# EAGLE board ADCS (EAGLE 9.6.0)
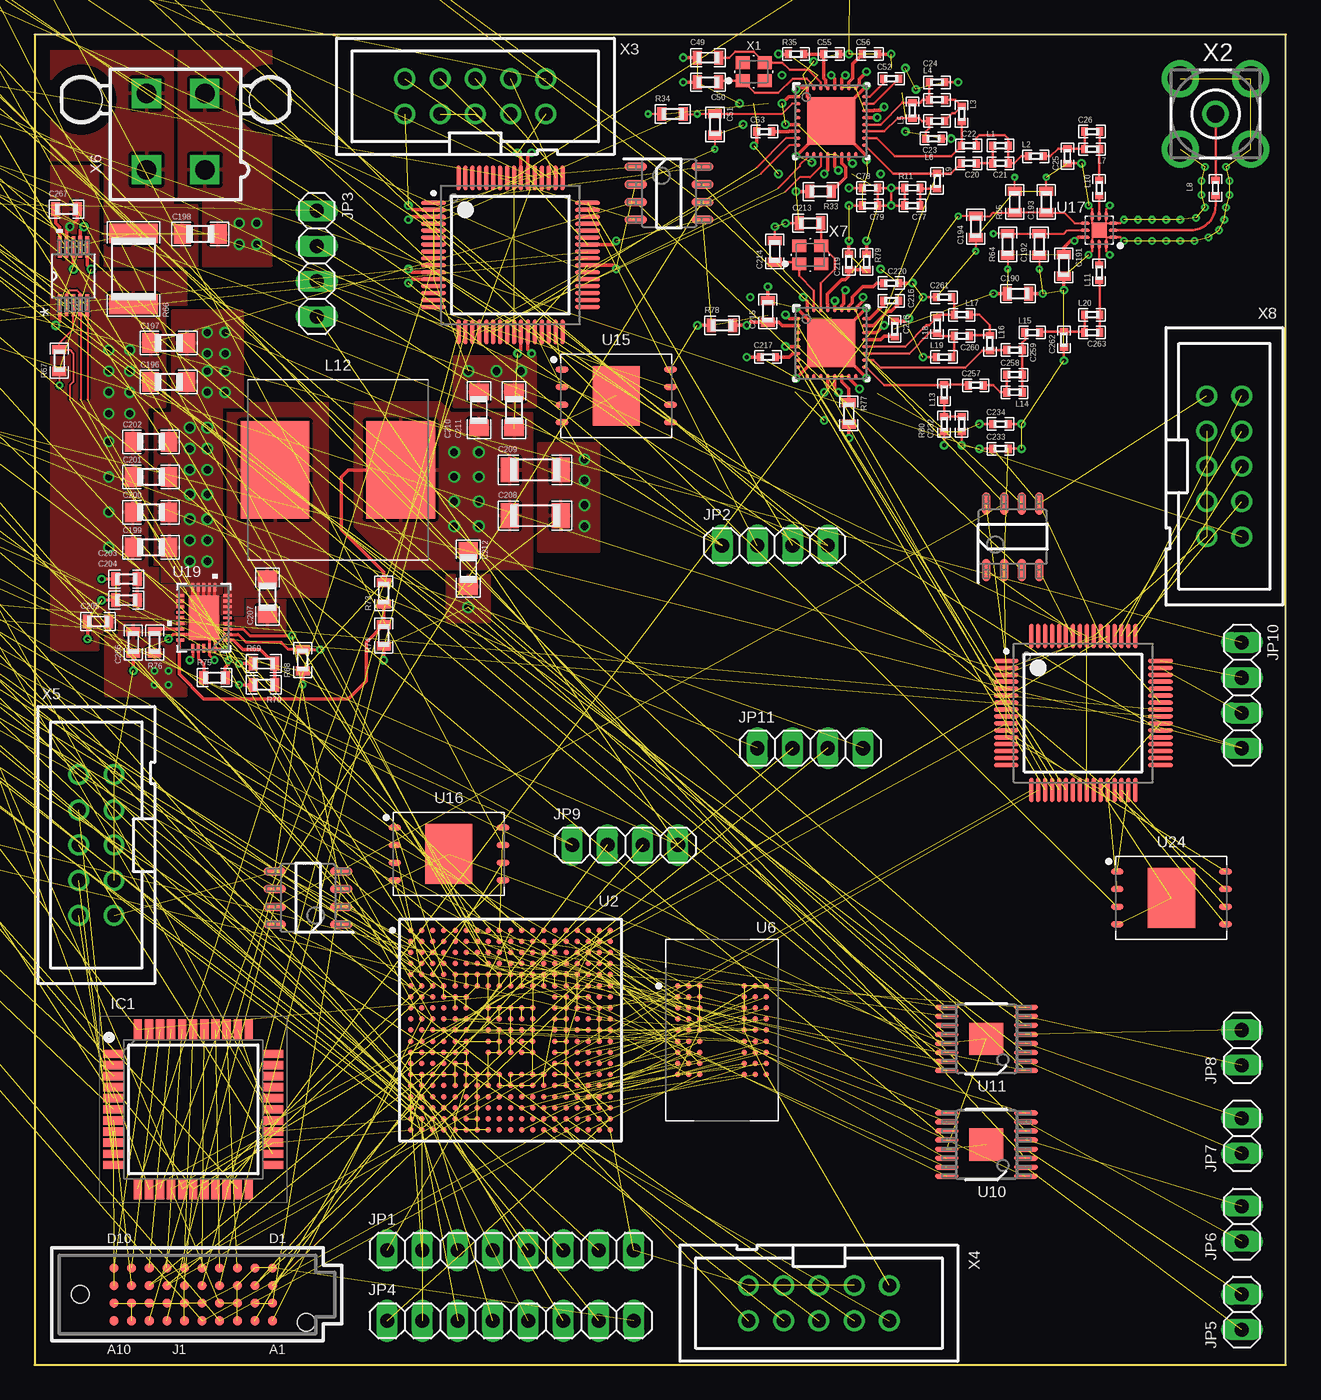
[diagram p13: board, top side]
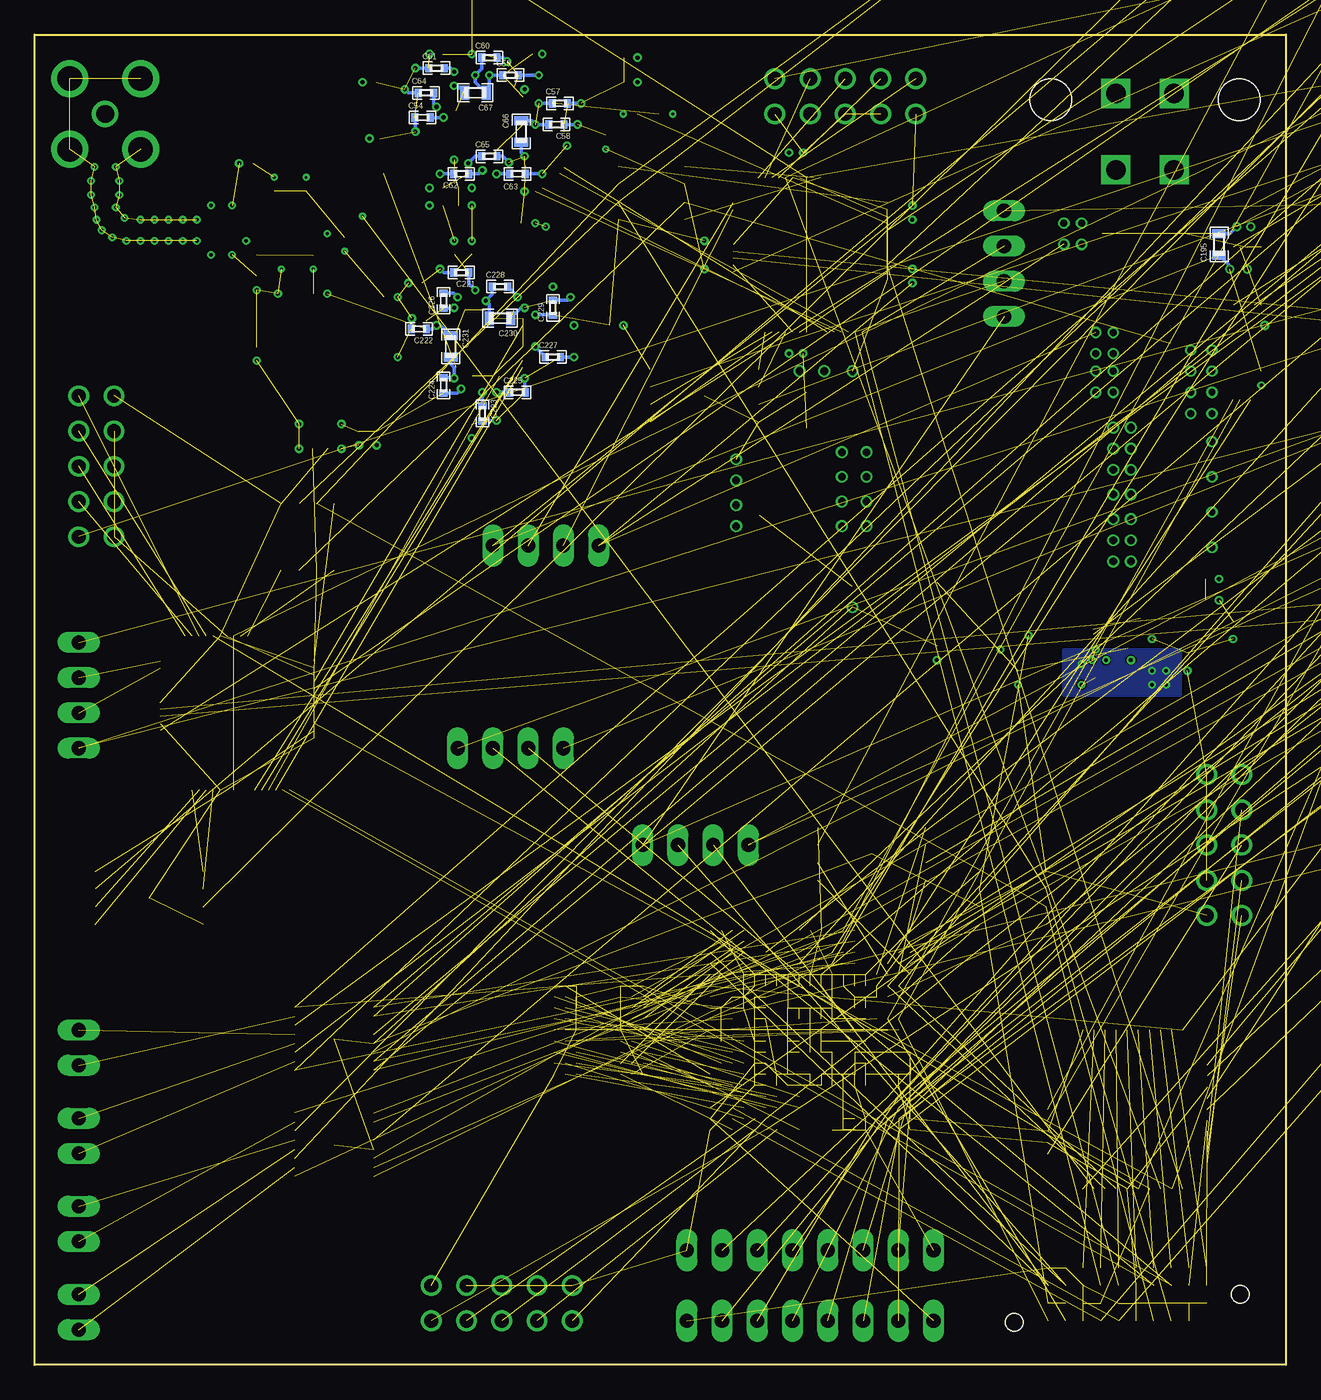
[diagram p14: board, bottom side, seen from below]

Size 90.17 x 95.89 mm. Coordinates in mm from the lower left corner, seen from the top.
Outline: 0,0 90.17,0 90.17,95.89 0,95.89 0,0
Copper layers (1+2*3+14*15+16): Top 0.035mm / dielectric 0.12mm / Route2 0.035mm / dielectric 0.12mm / Route3 0.035mm / dielectric 0.91mm / Route14 0.035mm / dielectric 0.12mm / Route15 0.035mm / dielectric 0.12mm / Bottom 0.035mm
Design rules "default *": minimum track width 4mil, minimum drill 0.2mm, track to track 4mil, track to pad 4mil, pad to pad 4mil, via to via 4mil, smd to smd 4mil, copper to edge 40mil, drill to drill 6mil, minimum pad ring 10mil, minimum via ring 6mil, stop-mask expansion 4mil, vias tented up to drill 0mil, thermal gap 10mil

## Footprints (pad centres in the part's own frame; a part is rotated, then mirrored left to right if it is on the bottom)
0603 = smd 0.65 x 1: 1 -0.775,0; 2 0.775,0
0402 = smd 0.5 x 0.6: 1 -0.55,0; 2 0.55,0
0805 = smd 1.2 x 1.4: 1 -1.3,0; 2 1.3,0
1206 = smd 1.3 x 1.8: 1 -1.85,0; 2 1.85,0
QFP80P1200X1200X120-44N = smd 1.475 x 0.6: 1 -5.738,4; 2 -5.738,3.2; 3 -5.738,2.4; 4 -5.738,1.6; 5 -5.738,0.8; 6 -5.738,0; 7 -5.738,-0.8; 8 -5.738,-1.6; 9 -5.738,-2.4; 10 -5.738,-3.2; 11 -5.738,-4; 23 5.738,-4; 24 5.738,-3.2; 25 5.738,-2.4; 26 5.738,-1.6; 27 5.738,-0.8; 28 5.738,0; 29 5.738,0.8; 30 5.738,1.6; 31 5.738,2.4; 32 5.738,3.2; 33 5.738,4 | smd 0.6 x 1.475: 12 -4,-5.738; 13 -3.2,-5.738; 14 -2.4,-5.738; 15 -1.6,-5.738; 16 -0.8,-5.738; 17 0,-5.738; 18 0.8,-5.738; 19 1.6,-5.738; 20 2.4,-5.738; 21 3.2,-5.738; 22 4,-5.738; 34 4,5.738; 35 3.2,5.738; 36 2.4,5.738; 37 1.6,5.738; 38 0.8,5.738; 39 0,5.738; 40 -0.8,5.738; 41 -1.6,5.738; 42 -2.4,5.738; 43 -3.2,5.738; 44 -4,5.738
SEAF-10-XX.X-XX-04-X-A = smd 0.635 x 0.635: A1 5.715,-1.905; A2 4.445,-1.905; A3 3.175,-1.905; A4 1.905,-1.905; A5 0.635,-1.905; A6 -0.635,-1.905; A7 -1.905,-1.905; A8 -3.175,-1.905; A9 -4.445,-1.905; A10 -5.715,-1.905; B1 5.715,-0.635; B2 4.445,-0.635; B3 3.175,-0.635; B4 1.905,-0.635; B5 0.635,-0.635; B6 -0.635,-0.635; B7 -1.905,-0.635; B8 -3.175,-0.635; B9 -4.445,-0.635; B10 -5.715,-0.635; C1 5.715,0.635; C2 4.445,0.635; C3 3.175,0.635; C4 1.905,0.635; C5 0.635,0.635; C6 -0.635,0.635; C7 -1.905,0.635; C8 -3.175,0.635; C9 -4.445,0.635; C10 -5.715,0.635; D1 5.715,1.905; D2 4.445,1.905; D3 3.175,1.905; D4 1.905,1.905; D5 0.635,1.905; D6 -0.635,1.905; D7 -1.905,1.905; D8 -3.175,1.905; D9 -4.445,1.905; D10 -5.715,1.905 | hole 1.27: 8.141,-2.007; -8.141,0
1X08 = drill 1.016 long: 1 -8.89,0; 2 -6.35,0; 3 -3.81,0; 4 -1.27,0; 5 1.27,0; 6 3.81,0; 7 6.35,0; 8 8.89,0
1X04 = drill 1.016 long: 1 -3.81,0; 2 -1.27,0; 3 1.27,0; 4 3.81,0
1X02 = drill 1.016 long: 1 -1.27,0; 2 1.27,0
BOURNS-INDUCTOR-SRR1208-4R5ML = smd 4.96 x 7.012: 1 -4.525,0; 2 4.525,0
1812 = smd 1.4 x 3.5: 1 -2.55,0; 2 2.55,0
TEXAS_INSTRUMENTS-RADAR-CC1200RHBR = smd 0.36 x 0.24: 1 -2.4,1.75; 2 -2.4,1.25; 3 -2.4,0.75; 4 -2.4,0.25; 5 -2.4,-0.25; 6 -2.4,-0.75; 7 -2.4,-1.25; 8 -2.4,-1.75; 17 2.4,-1.75; 18 2.4,-1.25; 19 2.4,-0.75; 20 2.4,-0.25; 21 2.4,0.25; 22 2.4,0.75; 23 2.4,1.25; 24 2.4,1.75 | smd 0.24 x 0.36: 9 -1.75,-2.4; 10 -1.25,-2.4; 11 -0.75,-2.4; 12 -0.25,-2.4; 13 0.25,-2.4; 14 0.75,-2.4; 15 1.25,-2.4; 16 1.75,-2.4; 25 1.75,2.4; 26 1.25,2.4; 27 0.75,2.4; 28 0.25,2.4; 29 -0.25,2.4; 30 -0.75,2.4; 31 -1.25,2.4; 32 -1.75,2.4 | smd 3.45 x 3.45: 33 0,0
ZWT0337A-IPC_A = smd 0.4 x 0.4: A1 -7.2,7.2; A2 -6.4,7.2; A3 -5.6,7.2; A4 -4.8,7.2; A5 -4,7.2; A6 -3.2,7.2; A7 -2.4,7.2; A8 -1.6,7.2; A9 -0.8,7.2; A10 0,7.2; A11 0.8,7.2; A12 1.6,7.2; A13 2.4,7.2; A14 3.2,7.2; A15 4,7.2; A16 4.8,7.2; A17 5.6,7.2; A18 6.4,7.2; A19 7.2,7.2; B1 -7.2,6.4; B2 -6.4,6.4; B3 -5.6,6.4; B4 -4.8,6.4; B5 -4,6.4; B6 -3.2,6.4; B7 -2.4,6.4; B8 -1.6,6.4; B9 -0.8,6.4; B10 0,6.4; B11 0.8,6.4; B12 1.6,6.4; B13 2.4,6.4; B14 3.2,6.4; B15 4,6.4; B16 4.8,6.4; B17 5.6,6.4; B18 6.4,6.4; B19 7.2,6.4; C1 -7.2,5.6; C2 -6.4,5.6; C3 -5.6,5.6; C4 -4.8,5.6; C5 -4,5.6; C6 -3.2,5.6; C7 -2.4,5.6; C8 -1.6,5.6; C9 -0.8,5.6; C10 0,5.6; C11 0.8,5.6; C12 1.6,5.6; C13 2.4,5.6; C14 3.2,5.6; C15 4,5.6; C16 4.8,5.6; C17 5.6,5.6; C18 6.4,5.6; C19 7.2,5.6; D1 -7.2,4.8; D2 -6.4,4.8; D3 -5.6,4.8; D4 -4.8,4.8; D5 -4,4.8; D6 -3.2,4.8; D7 -2.4,4.8; D8 -1.6,4.8; D9 -0.8,4.8; D10 0,4.8; D11 0.8,4.8; D12 1.6,4.8; D13 2.4,4.8; D14 3.2,4.8; D15 4,4.8; D16 4.8,4.8; D17 5.6,4.8; D18 6.4,4.8; D19 7.2,4.8; E1 -7.2,4; E2 -6.4,4; E3 -5.6,4; E4 -4.8,4; E5 -4,4; E6 -3.2,4; E7 -2.4,4; E8 -1.6,4; E9 -0.8,4; E10 0,4; E11 0.8,4; E12 1.6,4; E13 2.4,4; E14 3.2,4; E15 4,4; E16 4.8,4; E17 5.6,4; E18 6.4,4; E19 7.2,4; F1 -7.2,3.2; F2 -6.4,3.2; F3 -5.6,3.2; F4 -4.8,3.2; F5 -4,3.2; F6 -3.2,3.2; F7 -2.4,3.2; F8 -1.6,3.2; F9 -0.8,3.2; F10 0,3.2; F11 0.8,3.2; F12 1.6,3.2; F13 2.4,3.2; F14 3.2,3.2; F15 4,3.2; F16 4.8,3.2; F17 5.6,3.2; F18 6.4,3.2; F19 7.2,3.2; G1 -7.2,2.4; G2 -6.4,2.4; G3 -5.6,2.4; G4 -4.8,2.4; G5 -4,2.4; G6 -3.2,2.4; G14 3.2,2.4; G15 4,2.4; G16 4.8,2.4; G17 5.6,2.4; G18 6.4,2.4; G19 7.2,2.4; H1 -7.2,1.6; H2 -6.4,1.6; H3 -5.6,1.6; H4 -4.8,1.6; H5 -4,1.6; H6 -3.2,1.6; H8 -1.6,1.6; H9 -0.8,1.6; H10 0,1.6; H11 0.8,1.6; H12 1.6,1.6; H14 3.2,1.6; H15 4,1.6; H16 4.8,1.6; H17 5.6,1.6; H18 6.4,1.6; H19 7.2,1.6; J1 -7.2,0.8; J2 -6.4,0.8; J3 -5.6,0.8; J4 -4.8,0.8; J5 -4,0.8; J6 -3.2,0.8; J8 -1.6,0.8; J9 -0.8,0.8; J10 0,0.8; J11 0.8,0.8; J12 1.6,0.8; J14 3.2,0.8; J15 4,0.8; J16 4.8,0.8; J17 5.6,0.8; J18 6.4,0.8; J19 7.2,0.8; K1 -7.2,0; K2 -6.4,0; K3 -5.6,0; K4 -4.8,0; K5 -4,0; K6 -3.2,0; K8 -1.6,0; K9 -0.8,0; K10 0,0; K11 0.8,0; K12 1.6,0; K14 3.2,0; K15 4,0; K16 4.8,0; K17 5.6,0; K18 6.4,0; K19 7.2,0; L1 -7.2,-0.8; L2 -6.4,-0.8; L3 -5.6,-0.8; L4 -4.8,-0.8; L5 -4,-0.8; L6 -3.2,-0.8; L8 -1.6,-0.8; L9 -0.8,-0.8; L10 0,-0.8; L11 0.8,-0.8; L12 1.6,-0.8; L14 3.2,-0.8; L15 4,-0.8; L16 4.8,-0.8; L17 5.6,-0.8; L18 6.4,-0.8; L19 7.2,-0.8; M1 -7.2,-1.6; M2 -6.4,-1.6; M3 -5.6,-1.6; M4 -4.8,-1.6; M5 -4,-1.6; M6 -3.2,-1.6; M8 -1.6,-1.6; M9 -0.8,-1.6; M10 0,-1.6; M11 0.8,-1.6; M12 1.6,-1.6; M14 3.2,-1.6; M15 4,-1.6; M16 4.8,-1.6; M17 5.6,-1.6; M18 6.4,-1.6; M19 7.2,-1.6; N1 -7.2,-2.4; N2 -6.4,-2.4; N3 -5.6,-2.4; N4 -4.8,-2.4; N5 -4,-2.4; N6 -3.2,-2.4; N14 3.2,-2.4; N15 4,-2.4; N16 4.8,-2.4; N17 5.6,-2.4; N18 6.4,-2.4; N19 7.2,-2.4; P1 -7.2,-3.2; P2 -6.4,-3.2; P3 -5.6,-3.2; P4 -4.8,-3.2; P5 -4,-3.2; P6 -3.2,-3.2; P7 -2.4,-3.2; P8 -1.6,-3.2; P9 -0.8,-3.2; P10 0,-3.2; P11 0.8,-3.2; P12 1.6,-3.2; P13 2.4,-3.2; P14 3.2,-3.2; P15 4,-3.2; P16 4.8,-3.2; P17 5.6,-3.2; P18 6.4,-3.2; P19 7.2,-3.2; R1 -7.2,-4; R2 -6.4,-4; R3 -5.6,-4; R4 -4.8,-4; R5 -4,-4; R6 -3.2,-4; R7 -2.4,-4; R8 -1.6,-4; R9 -0.8,-4; R10 0,-4; R11 0.8,-4; R12 1.6,-4; R13 2.4,-4; R14 3.2,-4; R15 4,-4; R16 4.8,-4; R17 5.6,-4; R18 6.4,-4; R19 7.2,-4; T1 -7.2,-4.8; T2 -6.4,-4.8; T3 -5.6,-4.8; T4 -4.8,-4.8; T5 -4,-4.8; T6 -3.2,-4.8; T7 -2.4,-4.8; T8 -1.6,-4.8; T9 -0.8,-4.8; T10 0,-4.8; T11 0.8,-4.8; T12 1.6,-4.8; T13 2.4,-4.8; T14 3.2,-4.8; T15 4,-4.8; T16 4.8,-4.8; T17 5.6,-4.8; T18 6.4,-4.8; T19 7.2,-4.8; U1 -7.2,-5.6; U2 -6.4,-5.6; U3 -5.6,-5.6; U4 -4.8,-5.6; U5 -4,-5.6; U6 -3.2,-5.6; U7 -2.4,-5.6; U8 -1.6,-5.6; U9 -0.8,-5.6; U10 0,-5.6; U11 0.8,-5.6; U12 1.6,-5.6; U13 2.4,-5.6; U14 3.2,-5.6; U15 4,-5.6; U16 4.8,-5.6; U17 5.6,-5.6; U18 6.4,-5.6; U19 7.2,-5.6; V1 -7.2,-6.4; V2 -6.4,-6.4; V3 -5.6,-6.4; V4 -4.8,-6.4; V5 -4,-6.4; V6 -3.2,-6.4; V7 -2.4,-6.4; V8 -1.6,-6.4; V9 -0.8,-6.4; V10 0,-6.4; V11 0.8,-6.4; V12 1.6,-6.4; V13 2.4,-6.4; V14 3.2,-6.4; V15 4,-6.4; V16 4.8,-6.4; V17 5.6,-6.4; V18 6.4,-6.4; V19 7.2,-6.4; W1 -7.2,-7.2; W2 -6.4,-7.2; W3 -5.6,-7.2; W4 -4.8,-7.2; W5 -4,-7.2; W6 -3.2,-7.2; W7 -2.4,-7.2; W8 -1.6,-7.2; W9 -0.8,-7.2; W10 0,-7.2; W11 0.8,-7.2; W12 1.6,-7.2; W13 2.4,-7.2; W14 3.2,-7.2; W15 4,-7.2; W16 4.8,-7.2; W17 5.6,-7.2; W18 6.4,-7.2; W19 7.2,-7.2
PM0064A_N = smd 1.8 x 0.3: 1 -5.55,3.75; 2 -5.55,3.25; 3 -5.55,2.75; 4 -5.55,2.25; 5 -5.55,1.75; 6 -5.55,1.25; 7 -5.55,0.75; 8 -5.55,0.25; 9 -5.55,-0.25; 10 -5.55,-0.75; 11 -5.55,-1.25; 12 -5.55,-1.75; 13 -5.55,-2.25; 14 -5.55,-2.75; 15 -5.55,-3.25; 16 -5.55,-3.75; 33 5.55,-3.75; 34 5.55,-3.25; 35 5.55,-2.75; 36 5.55,-2.25; 37 5.55,-1.75; 38 5.55,-1.25; 39 5.55,-0.75; 40 5.55,-0.25; 41 5.55,0.25; 42 5.55,0.75; 43 5.55,1.25; 44 5.55,1.75; 45 5.55,2.25; 46 5.55,2.75; 47 5.55,3.25; 48 5.55,3.75 | smd 0.3 x 1.8: 17 -3.75,-5.55; 18 -3.25,-5.55; 19 -2.75,-5.55; 20 -2.25,-5.55; 21 -1.75,-5.55; 22 -1.25,-5.55; 23 -0.75,-5.55; 24 -0.25,-5.55; 25 0.25,-5.55; 26 0.75,-5.55; 27 1.25,-5.55; 28 1.75,-5.55; 29 2.25,-5.55; 30 2.75,-5.55; 31 3.25,-5.55; 32 3.75,-5.55; 49 3.75,5.55; 50 3.25,5.55; 51 2.75,5.55; 52 2.25,5.55; 53 1.75,5.55; 54 1.25,5.55; 55 0.75,5.55; 56 0.25,5.55; 57 -0.25,5.55; 58 -0.75,5.55; 59 -1.25,5.55; 60 -1.75,5.55; 61 -2.25,5.55; 62 -2.75,5.55; 63 -3.25,5.55; 64 -3.75,5.55
TEXAS_INSTRUMENTS-CAN_TRANSCEIVER-TCAN1042/LED_DRIVER-TLC59731DR = smd 1.6 x 0.6: 1 -2.4,1.905; 2 -2.4,0.635; 3 -2.4,-0.635; 4 -2.4,-1.905; 5 2.4,-1.905; 6 2.4,-0.635; 7 2.4,0.635; 8 2.4,1.905
TEXAS_INSTRUMENTS-AND_GATE-SN74LVC1G11_DCK_6 = smd 1.168 x 0.356: 1 -0.978,0.65; 2 -0.978,0; 3 -0.978,-0.65; 4 0.978,-0.65; 5 0.978,0; 6 0.978,0.65
ISSI-DRAM-IS42S16320F-7TL = smd 0.4 x 0.4: A1 -3.2,3.2; A2 -2.4,3.2; A3 -1.6,3.2; A7 1.6,3.2; A8 2.4,3.2; A9 3.2,3.2; B1 -3.2,2.4; B2 -2.4,2.4; B3 -1.6,2.4; B7 1.6,2.4; B8 2.4,2.4; B9 3.2,2.4; C1 -3.2,1.6; C2 -2.4,1.6; C3 -1.6,1.6; C7 1.6,1.6; C8 2.4,1.6; C9 3.2,1.6; D1 -3.2,0.8; D2 -2.4,0.8; D3 -1.6,0.8; D7 1.6,0.8; D8 2.4,0.8; D9 3.2,0.8; E1 -3.2,0; E2 -2.4,0; E3 -1.6,0; E7 1.6,0; E8 2.4,0; E9 3.2,0; F1 -3.2,-0.8; F2 -2.4,-0.8; F3 -1.6,-0.8; F7 1.6,-0.8; F8 2.4,-0.8; F9 3.2,-0.8; G1 -3.2,-1.6; G2 -2.4,-1.6; G3 -1.6,-1.6; G7 1.6,-1.6; G8 2.4,-1.6; G9 3.2,-1.6; H1 -3.2,-2.4; H2 -2.4,-2.4; H3 -1.6,-2.4; H7 1.6,-2.4; H8 2.4,-2.4; H9 3.2,-2.4; J1 -3.2,-3.2; J2 -2.4,-3.2; J3 -1.6,-3.2; J7 1.6,-3.2; J8 2.4,-3.2; J9 3.2,-3.2
SOT23-6 = smd 0.635 x 1.27: P$1 -0.953,-1.27; P$2 0,-1.27; P$3 0.953,-1.27; P$4 0.953,1.27; P$5 0,1.27; P$6 -0.953,1.27
PQFN50P250X300X100-14N = smd 0.58 x 0.35: 1 -1.16,0.75; 2 -1.16,0.25; 3 -1.16,-0.25; 4 -1.16,-0.75; 8 1.16,-0.75; 9 1.16,-0.25; 10 1.16,0.25; 11 1.16,0.75 | smd 0.35 x 0.58: 5 -0.5,-0.91; 6 0,-0.91; 7 0.5,-0.91; 12 0.5,0.91; 13 0,0.91; 14 -0.5,0.91
PWP0016K_N = smd 1.7 x 0.35: 1 -2.85,2.275; 2 -2.85,1.625; 3 -2.85,0.975; 4 -2.85,0.325; 5 -2.85,-0.325; 6 -2.85,-0.975; 7 -2.85,-1.625; 8 -2.85,-2.275; 9 2.85,-2.275; 10 2.85,-1.625; 11 2.85,-0.975; 12 2.85,-0.325; 13 2.85,0.325; 14 2.85,0.975; 15 2.85,1.625; 16 2.85,2.275 | smd 2.46 x 2.31: 17 0,0
TEXAS_INSTRUMENTS-CURRENT_MONITOR-INA226_DGS_10 = smd 1.575 x 0.279: 1 -2.095,1; 2 -2.095,0.5; 3 -2.095,0; 4 -2.095,-0.5; 5 -2.095,-1; 6 2.095,-1; 7 2.095,-0.5; 8 2.095,0; 9 2.095,0.5; 10 2.095,1
KIOXIA_AMERICA-NAND_FLASH-TC58CVG0S3HRAIG = smd 0.911 x 0.42: 1 -3.901,1.905; 2 -3.901,0.635; 3 -3.901,-0.635; 4 -3.901,-1.905; 5 3.901,-1.905; 6 3.901,-0.635; 7 3.901,0.635; 8 3.901,1.905 | smd 3.4 x 4.3: 9 0,0
QORVO-RF_SWITCH-QPC7512 = smd 0.687 x 0.232: 1 -1.012,0.5; 2 -1.012,0; 3 -1.012,-0.5; 7 1.012,-0.5; 8 1.012,0; 9 1.012,0.5 | smd 0.232 x 0.687: 4 -0.5,-1.012; 5 0,-1.012; 6 0.5,-1.012; 10 0.5,1.012; 11 0,1.012; 12 -0.5,1.012 | smd 1.1 x 1.1: 13 0,0
RVE28_TEX = smd 0.61 x 0.203: 1 -1.702,1.6; 2 -1.702,1.2; 3 -1.702,0.8; 4 -1.702,0.4; 5 -1.702,0; 6 -1.702,-0.4; 7 -1.702,-0.8; 8 -1.702,-1.2; 9 -1.702,-1.6; 15 1.702,-1.6; 16 1.702,-1.2; 17 1.702,-0.8; 18 1.702,-0.4; 19 1.702,0; 20 1.702,0.4; 21 1.702,0.8; 22 1.702,1.2; 23 1.702,1.6 | smd 0.203 x 0.61: 10 -0.8,-2.197; 11 -0.4,-2.197; 12 0,-2.197; 13 0.4,-2.197; 14 0.8,-2.197; 24 0.8,2.197; 25 0.4,2.197; 26 0,2.197; 27 -0.4,2.197; 28 -0.8,2.197 | smd 2.21 x 3.2: 29 0,0
ECS_INC-OSCILLATOR-ECS-400-10-37-CKM-TR = smd 1.012 x 0.912: 1 -0.8,-0.65; 2 0.8,-0.65; 3 0.8,0.65; 4 -0.8,0.65
BU-SMA-V = drill 1.27: 1 0,0 | drill 1.778: 2 -2.55,2.55; 3 2.55,2.55; 4 2.55,-2.55; 5 -2.55,-2.55
PAK100/2500-10 = drill 1 pad 1.422: 1 -5.08,-1.27; 2 -5.08,1.27; 3 -2.54,-1.27; 4 -2.54,1.27; 5 0,-1.27; 6 0,1.27; 7 2.54,-1.27; 8 2.54,1.27; 9 5.08,-1.27; 10 5.08,1.27
5566-4 = drill 1.4 square: 1 2.1,-2.75; 2 -2.1,-2.75; 3 2.1,2.75; 4 -2.1,2.75 | hole 3: 6.8,2.29; -6.8,2.29
ESC-OSCILLATOR-ECS_200_9_33B_CTP_TR = smd 1.312 x 1.212: 1 -1.2,-0.9; 2 1.2,-0.9; 3 1.2,0.9; 4 -1.2,0.9

## Placement (x,y rotation side)
C1  0.1uF  [0603]  -39.37,101.6 0 top  (outside the outline)
C2  0.1uF  [0603]  -43.18,101.6 0 top  (outside the outline)
C3  DNI  [0603]  -46.99,101.6 0 top  (outside the outline)
C4  DNI  [0603]  -50.8,101.6 0 top  (outside the outline)
C5  2.2uF  [0603]  -54.61,101.6 0 top  (outside the outline)
C6  1uF  [0603]  -58.42,101.6 0 top  (outside the outline)
C7  0.1uF  [0603]  57.91,100.08 0 top  (outside the outline)
C8  0.1uF  [0603]  -66.04,101.6 0 top  (outside the outline)
C9  1uF  [0603]  -69.85,101.6 0 top  (outside the outline)
C10  1uF  [0603]  -73.66,101.6 0 top  (outside the outline)
C11  10uF  [0603]  -77.47,101.6 0 top  (outside the outline)
C12  4.7uF  [0603]  -81.28,101.6 0 top  (outside the outline)
C13  1uF  [0603]  -85.09,101.6 0 top  (outside the outline)
C14  1uF  [0603]  -88.9,101.6 0 top  (outside the outline)
C15  0.1uF  [0603]  -92.71,101.6 0 top  (outside the outline)
C16  0.1uF  [0603]  -96.52,101.6 0 top  (outside the outline)
C17  0.1uF  [0603]  -100.33,101.6 0 top  (outside the outline)
C18  0.1uF  [0603]  -104.14,101.6 0 top  (outside the outline)
C19  1uF  [0603]  -107.95,101.6 0 top  (outside the outline)
C20  15pF  [0402]  67.31,86.61 0 top
C21  1pF  [0402]  69.6,86.61 0 top
C22  2.2pF  [0402]  67.31,87.88 180 top
C23  3.3pF  [0402]  65.02,89.66 0 top
C24  3.3pF  [0402]  65.02,92.46 180 top
C25  3pF  [0402]  74.42,87.12 270 top
C26  DNI  [0402]  76.2,88.9 0 top
C27  0.1uF  [0402]  -63.5,132.08 0 top  (outside the outline)
C28  0.1uF  [0402]  -66.04,132.08 0 top  (outside the outline)
C29  1uF  [0402]  -68.58,132.08 0 top  (outside the outline)
C30  0.01uF  [0603]  -19.05,105.41 0 top  (outside the outline)
C31  0.1uF  [0603]  -22.86,105.41 0 top  (outside the outline)
C32  0.01uF  [0603]  -26.67,105.41 0 top  (outside the outline)
C33  0.1uF  [0402]  -71.12,132.08 0 top  (outside the outline)
C34  0.1uF  [0402]  -73.66,132.08 0 top  (outside the outline)
C35  0.1uF  [0402]  -76.2,132.08 0 top  (outside the outline)
C36  0.1uF  [0402]  -78.74,132.08 0 top  (outside the outline)
C37  0.1uF  [0402]  -81.28,132.08 0 top  (outside the outline)
C38  0.1uF  [0402]  -83.82,132.08 0 top  (outside the outline)
C39  0.1uF  [0402]  -86.36,132.08 0 top  (outside the outline)
C40  0.1uF  [0402]  -88.9,132.08 0 top  (outside the outline)
C41  0.1uF  [0402]  -91.44,132.08 0 top  (outside the outline)
C42  0.1uF  [0402]  -93.98,132.08 0 top  (outside the outline)
C43  0.1uF  [0402]  -96.52,132.08 0 top  (outside the outline)
C44  0.1uF  [0402]  -99.06,132.08 0 top  (outside the outline)
C45  0.1uF  [0402]  -101.6,132.08 0 top  (outside the outline)
C46  0.1uF  [0402]  -104.14,132.08 0 top  (outside the outline)
C47  0.1uF  [0402]  -106.68,132.08 0 top  (outside the outline)
C48  0.1uF  [0402]  -109.22,132.08 0 top  (outside the outline)
C49  10pF  [0603]  48.51,94.23 180 top
C50  10pF  [0603]  48.51,92.46 180 top
C51  0.1uF  [0603]  49.02,89.41 270 top
C52  1.5nF  [0402]  61.72,92.71 0 top
C53  220nF  [0402]  52.58,88.9 0 top
C54  10nF  [0402]  62.23,89.92 0 bottom
C55  47nF  [0402]  57.4,94.49 180 top
C56  47nF  [0402]  60.2,94.49 180 top
C57  47nF  [0402]  52.32,90.93 0 bottom
C58  47nF  [0402]  52.58,89.41 0 bottom
C59  47nF  [0402]  55.88,92.96 0 bottom
C60  47nF  [0402]  57.4,94.23 0 bottom
C61  47nF  [0402]  61.21,93.47 180 bottom
C62  47nF  [0402]  59.44,85.85 180 bottom
C63  47nF  [0402]  55.37,85.85 0 bottom
C64  47nF  [0402]  61.98,91.69 180 bottom
C65  47nF  [0402]  57.4,87.12 0 bottom
C66  10uF  [0603]  55.12,88.9 270 bottom
C67  2.2uF  [0603]  58.42,91.69 180 bottom
C68  0.1uF  [0402]  -29.21,135.89 0 top  (outside the outline)
C69  0.1uF  [0402]  -31.75,135.89 0 top  (outside the outline)
C70  0.1uF  [0402]  -34.29,135.89 0 top  (outside the outline)
C71  0.1uF  [0402]  -36.83,135.89 0 top  (outside the outline)
C72  0.1uF  [0402]  -39.37,135.89 0 top  (outside the outline)
C73  0.1uF  [0402]  -41.91,135.89 0 top  (outside the outline)
C74  0.1uF  [0402]  -44.45,135.89 0 top  (outside the outline)
C75  0.1uF  [0402]  -46.99,135.89 0 top  (outside the outline)
C76  0.1uF  [0402]  -49.53,135.89 0 top  (outside the outline)
C77  33pF  [0402]  63.25,83.57 0 top
C78  10nF  [0402]  60.2,84.84 180 top
C79  100pF  [0402]  60.2,83.57 180 top
C80  0.1uF  [0402]  -59.69,135.89 0 top  (outside the outline)
C81  0.1uF  [0402]  -62.23,135.89 0 top  (outside the outline)
C82  0.1uF  [0402]  -64.77,135.89 0 top  (outside the outline)
C83  0.1uF  [0402]  -67.31,135.89 0 top  (outside the outline)
C84  0.1uF  [0402]  -69.85,135.89 0 top  (outside the outline)
C85  1uF  [0402]  -72.39,135.89 0 top  (outside the outline)
C86  1uF  [0402]  -74.93,135.89 0 top  (outside the outline)
C87  1uF  [0402]  -77.47,135.89 0 top  (outside the outline)
C88  2.2uF  [0402]  -80.01,135.89 0 top  (outside the outline)
C89  4.7uF  [0603]  -49.53,105.41 0 top  (outside the outline)
C90  10uF  [0603]  -53.34,105.41 0 top  (outside the outline)
C91  2.2uF  [0402]  -82.55,135.89 0 top  (outside the outline)
C92  2.2uF  [0402]  -85.09,135.89 0 top  (outside the outline)
C93  0.1uF  [0402]  -87.63,135.89 0 top  (outside the outline)
C94  0.1uF  [0402]  -90.17,135.89 0 top  (outside the outline)
C95  0.1uF  [0402]  -92.71,135.89 0 top  (outside the outline)
C96  0.1uF  [0402]  -95.25,135.89 0 top  (outside the outline)
C97  2.2uF  [0402]  -97.79,135.89 0 top  (outside the outline)
C98  0.1uF  [0402]  -100.33,135.89 0 top  (outside the outline)
C99  0.1uF  [0402]  -102.87,135.89 0 top  (outside the outline)
C100  0.1uF  [0402]  -105.41,135.89 0 top  (outside the outline)
C101  0.1uF  [0402]  -107.95,135.89 0 top  (outside the outline)
C102  0.1uF  [0402]  -110.49,135.89 0 top  (outside the outline)
C103  0.1uF  [0402]  -113.03,135.89 0 top  (outside the outline)
C104  0.1uF  [0402]  -115.57,135.89 0 top  (outside the outline)
C105  0.1uF  [0402]  -118.11,135.89 0 top  (outside the outline)
C106  0.1uF  [0402]  -120.65,135.89 0 top  (outside the outline)
C107  0.1uF  [0402]  -123.19,135.89 0 top  (outside the outline)
C108  0.1uF  [0402]  -125.73,135.89 0 top  (outside the outline)
C109  0.1uF  [0402]  -128.27,135.89 0 top  (outside the outline)
C110  0.1uF  [0402]  -130.81,135.89 0 top  (outside the outline)
C111  0.1uF  [0402]  -13.97,139.7 0 top  (outside the outline)
C112  1uF  [0402]  -16.51,139.7 0 top  (outside the outline)
C113  1uF  [0402]  -19.05,139.7 0 top  (outside the outline)
C114  1uF  [0402]  -21.59,139.7 0 top  (outside the outline)
C115  4.7uF  [0603]  -57.15,105.41 0 top  (outside the outline)
C116  4.7uF  [0603]  -60.96,105.41 0 top  (outside the outline)
C117  10uF  [0603]  -64.77,105.41 0 top  (outside the outline)
C118  10nF  [0603]  -68.58,105.41 0 top  (outside the outline)
C119  10nF  [0603]  -72.39,105.41 0 top  (outside the outline)
C120  22uF  [0603]  -76.2,105.41 0 top  (outside the outline)
C121  22uF  [0603]  -80.01,105.41 0 top  (outside the outline)
C122  22uF  [0603]  -83.82,105.41 0 top  (outside the outline)
C123  22uF  [0603]  -87.63,105.41 0 top  (outside the outline)
C124  0.1uF  [0603]  -91.44,105.41 0 top  (outside the outline)
C125  0.1uF  [0603]  -95.25,105.41 0 top  (outside the outline)
C126  0.1uF  [0603]  -99.06,105.41 0 top  (outside the outline)
C127  0.1uF  [0603]  -102.87,105.41 0 top  (outside the outline)
C128  0.1uF  [0603]  -106.68,105.41 0 top  (outside the outline)
C129  0.1uF  [0603]  -110.49,105.41 0 top  (outside the outline)
C130  0.1uF  [0603]  -114.3,105.41 0 top  (outside the outline)
C131  1uF  [0603]  -118.11,105.41 0 top  (outside the outline)
C132  1uF  [0603]  -121.92,105.41 0 top  (outside the outline)
C133  1uF  [0603]  -125.73,105.41 0 top  (outside the outline)
C134  2.2uF  [0603]  -129.54,105.41 0 top  (outside the outline)
C135  10uF  [0603]  -15.24,109.22 0 top  (outside the outline)
C136  10uF  [0603]  -19.05,109.22 0 top  (outside the outline)
C137  0.1uF  [0603]  -22.86,109.22 0 top  (outside the outline)
C138  0.1uF  [0603]  -26.67,109.22 0 top  (outside the outline)
C139  0.1uF  [0603]  -30.48,109.22 0 top  (outside the outline)
C140  0.1uF  [0603]  -34.29,109.22 0 top  (outside the outline)
C141  0.1uF  [0603]  -38.1,109.22 0 top  (outside the outline)
C142  0.1uF  [0603]  -41.91,109.22 0 top  (outside the outline)
C143  0.1uF  [0603]  -45.72,109.22 0 top  (outside the outline)
C144  0.1uF  [0603]  -49.53,109.22 0 top  (outside the outline)
C145  0.1uF  [0603]  -53.34,109.22 0 top  (outside the outline)
C146  0.1uF  [0603]  -57.15,109.22 0 top  (outside the outline)
C147  0.1uF  [0603]  -60.96,109.22 0 top  (outside the outline)
C148  0.1uF  [0603]  -64.77,109.22 0 top  (outside the outline)
C149  0.1uF  [0603]  -68.58,109.22 0 top  (outside the outline)
C150  0.1uF  [0603]  -72.39,109.22 0 top  (outside the outline)
C151  0.1uF  [0603]  -76.2,109.22 0 top  (outside the outline)
C152  0.1uF  [0603]  -80.01,109.22 0 top  (outside the outline)
C153  0.1uF  [0603]  -83.82,109.22 0 top  (outside the outline)
C154  0.1uF  [0603]  -87.63,109.22 0 top  (outside the outline)
C155  0.1uF  [0603]  -91.44,109.22 0 top  (outside the outline)
C156  0.1uF  [0603]  -95.25,109.22 0 top  (outside the outline)
C157  2.2uF  [0603]  -99.06,109.22 0 top  (outside the outline)
C158  10uF  [0805]  -80.01,96.52 0 top  (outside the outline)
C159  0.1uF  [0603]  -102.87,109.22 0 top  (outside the outline)
C160  2.2uF  [0603]  -106.68,109.22 0 top  (outside the outline)
C161  10uF  [0805]  -85.09,96.52 0 top  (outside the outline)
C162  0.1uF  [0603]  -110.49,109.22 0 top  (outside the outline)
C163  0.1uF  [0603]  -114.3,109.22 0 top  (outside the outline)
C164  10uF  [0805]  -90.17,96.52 0 top  (outside the outline)
C165  0.1uF  [0603]  -118.11,109.22 0 top  (outside the outline)
C166  0.1uF  [0603]  -121.92,109.22 0 top  (outside the outline)
C167  2.2uF  [0603]  -125.73,109.22 0 top  (outside the outline)
C168  0.1uF  [0603]  -129.54,109.22 0 top  (outside the outline)
C169  2.2uF  [0603]  -15.24,113.03 0 top  (outside the outline)
C170  0.1uF  [0603]  -19.05,113.03 0 top  (outside the outline)
C171  1uF  [0603]  -22.86,113.03 0 top  (outside the outline)
C172  0.1uF  [0603]  -26.67,113.03 0 top  (outside the outline)
C173  1uF  [0603]  -30.48,113.03 0 top  (outside the outline)
C174  0.1uF  [0603]  -34.29,113.03 0 top  (outside the outline)
C175  0.1uF  [0603]  -38.1,113.03 0 top  (outside the outline)
C176  0.1uF  [0603]  -41.91,113.03 0 top  (outside the outline)
C177  0.1uF  [0603]  -45.72,113.03 0 top  (outside the outline)
C178  0.1uF  [0603]  -49.53,113.03 0 top  (outside the outline)
C179  0.1uF  [0603]  -53.34,113.03 0 top  (outside the outline)
C180  0.1uF  [0603]  -57.15,113.03 0 top  (outside the outline)
C181  0.1uF  [0603]  -60.96,113.03 0 top  (outside the outline)
C182  1uF  [0603]  -64.77,113.03 0 top  (outside the outline)
C183  4.7uF  [0603]  -68.58,113.03 0 top  (outside the outline)
C184  [0603]  -91.44,138.43 0 top  (outside the outline)
C185  0.1uF  [0603]  -72.39,113.03 0 top  (outside the outline)
C186  1uF  [0603]  -76.2,113.03 0 top  (outside the outline)
C187  0.1uF  [0603]  -80.01,113.03 0 top  (outside the outline)
C188  1uF  [0603]  -83.82,113.03 0 top  (outside the outline)
C189  10nF  [0603]  -87.63,113.03 0 top  (outside the outline)
C190  0.1uF  [0603]  70.87,77.22 0 top
C191  10nF  [0603]  74.17,79.25 270 top
C192  100pF  [0603]  72.39,80.77 270 top
C193  100pF  [0603]  72.9,83.82 90 top
C194  10nF  [0603]  67.82,82.04 270 top
C195  0.1uF  [0603]  4.83,80.77 90 bottom
C196  10uF  [0805]  9.65,70.87 0 top
C197  22uF  [0805]  9.65,73.66 0 top
C198  DNI  [0805]  11.94,81.53 0 top
C199  10uF  [0805]  8.38,58.93 0 top
C200  10uF  [0805]  8.38,61.47 0 top
C201  10uF  [0805]  8.38,64.01 0 top
C202  10uF  [0805]  8.38,66.55 0 top
C203  2.2uF  [0603]  6.6,56.64 180 top
C204  0.1uF  [0603]  6.6,55.12 180 top
C205  2.2uF  [0603]  4.57,53.59 180 top
C206  2.2uF  [0603]  7.11,52.07 270 top
C207  100nF  [0805]  16.76,55.37 90 top
C208  47uF  [1206]  36.07,61.21 0 top
C209  100uF  [1206]  36.07,64.52 0 top
C210  10uF  [0805]  32,68.83 90 top
C211  22uF  [0805]  34.54,68.83 90 top
C212  0.1uF  [0805]  31.24,57.4 270 top
C213  10pF  [0603]  55.88,82.3 180 top
C214  10pF  [0603]  53.34,80.26 90 top
C215  0.1uF  [0603]  52.83,75.95 90 top
C216  1.5nF  [0402]  61.72,76.71 0 top
C217  220nF  [0402]  52.83,72.64 0 top
C218  10nF  [0402]  61.98,74.68 270 top
C219  47nF  [0402]  58.67,79.5 270 top
C220  47nF  [0402]  61.72,77.98 180 top
C221  47nF  [0402]  59.44,78.74 180 bottom
C222  47nF  [0402]  62.48,74.68 180 bottom
C223  47nF  [0402]  57.91,68.58 270 bottom
C224  47nF  [0402]  60.71,70.61 90 bottom
C225  47nF  [0402]  55.37,70.1 0 bottom
C226  47nF  [0402]  60.71,76.71 270 bottom
C227  47nF  [0402]  52.83,72.64 0 bottom
C228  47nF  [0402]  56.64,77.72 0 bottom
C229  47nF  [0402]  52.83,76.2 90 bottom
C230  10uF  [0603]  56.64,75.44 0 bottom
C231  2.2uF  [0603]  60.2,73.41 270 bottom
C232  33pF  [0402]  66.8,67.82 90 top
C233  10nF  [0402]  69.6,66.04 0 top
C234  100pF  [0402]  69.6,67.82 0 top
C235  0.01uF  [0603]  -30.48,116.84 0 top  (outside the outline)
C236  0.1uF  [0603]  -34.29,116.84 0 top  (outside the outline)
C237  0.01uF  [0603]  -38.1,116.84 0 top  (outside the outline)
C238  0.1uF  [0603]  -41.91,116.84 0 top  (outside the outline)
C239  0.1uF  [0603]  -45.72,116.84 0 top  (outside the outline)
C240  DNI  [0603]  -49.53,116.84 0 top  (outside the outline)
C241  DNI  [0603]  -53.34,116.84 0 top  (outside the outline)
C242  2.2uF  [0603]  -57.15,116.84 0 top  (outside the outline)
C243  1uF  [0603]  -60.96,116.84 0 top  (outside the outline)
C244  0.1uF  [0603]  -64.77,116.84 0 top  (outside the outline)
C245  0.1uF  [0603]  -68.58,116.84 0 top  (outside the outline)
C246  1uF  [0603]  -72.39,116.84 0 top  (outside the outline)
C247  1uF  [0603]  -76.2,116.84 0 top  (outside the outline)
C248  10uF  [0603]  -80.01,116.84 0 top  (outside the outline)
C249  4.7uF  [0603]  -83.82,116.84 0 top  (outside the outline)
C250  1uF  [0603]  -87.63,116.84 0 top  (outside the outline)
C251  1uF  [0603]  -91.44,116.84 0 top  (outside the outline)
C252  0.1uF  [0603]  -95.25,116.84 0 top  (outside the outline)
C253  0.1uF  [0603]  -99.06,116.84 0 top  (outside the outline)
C254  0.1uF  [0603]  -102.87,116.84 0 top  (outside the outline)
C255  0.1uF  [0603]  -106.68,116.84 0 top  (outside the outline)
C256  1uF  [0603]  -110.49,116.84 0 top  (outside the outline)
C257  15pF  [0402]  67.82,70.61 0 top
C258  1pF  [0402]  70.61,71.37 0 top
C259  2.2pF  [0402]  70.61,73.15 180 top
C260  3.3pF  [0402]  66.8,74.17 0 top
C261  3.3pF  [0402]  65.53,76.96 0 top
C262  3pF  [0402]  74.17,73.91 270 top
C263  DNI  [0402]  76.2,74.42 0 top
C264  0.1uF  [0603]  -22.86,120.65 0 top  (outside the outline)
C265  1uF  [0603]  -26.67,120.65 0 top  (outside the outline)
C266  10nF  [0603]  -30.48,120.65 0 top  (outside the outline)
C267  0.1uF  [0603]  2.29,83.31 0 top
C268  0.1uF  [0603]  -137.67,1.78 0 top  (outside the outline)
C269  0.1uF  [0603]  -140.97,1.78 0 top  (outside the outline)
IC1  XC9572XL-10VQG44C  [QFP80P1200X1200X120-44N]  11.43,18.41 0 top
J1  SEAF-10-XX.X-XX-04-X-A  [SEAF-10-XX.X-XX-04-X-A]  11.43,5.08 0 top
JP1  [1X08]  34.29,8.26 0 top
JP2  [1X04]  53.34,59.05 180 top
JP3  [1X04]  20.32,79.38 270 top
JP4  [1X08]  34.29,3.17 0 top
JP5  [1X02]  87,3.81 90 top
JP6  [1X02]  87,10.16 90 top
JP7  [1X02]  87,16.51 90 top
JP8  [1X02]  87,22.86 90 top
JP9  [1X04]  42.55,37.47 0 top
JP10  [1X04]  87,48.26 270 top
JP11  [1X04]  55.88,44.45 0 top
L1  7.5nH  [0402]  69.6,87.88 0 top
L2  18nH  [0402]  72.14,87.12 0 top
L3  12nH  [0402]  66.8,90.17 270 top
L4  12nH  [0402]  65.02,91.19 0 top
L5  15nH  [0402]  63.25,90.42 90 top
L6  12nH  [0402]  64.77,88.39 180 top
L7  12nH  [0402]  76.2,87.63 0 top
L8  1.2nH  [0402]  85.09,84.84 90 top
L9  10nH  [0402]  65.02,85.34 270 top
L10  1.2nH  [0402]  76.71,84.84 270 top
L11  1.2nH  [0402]  76.71,78.74 90 top
L12  4.5uH  [BOURNS-INDUCTOR-SRR1208-4R5ML]  21.84,64.52 0 top
L13  10nH  [0402]  65.53,70.1 270 top
L14  7.5nH  [0402]  70.61,70.1 0 top
L15  18nH  [0402]  71.88,74.42 0 top
L16  12nH  [0402]  68.83,73.66 270 top
L17  12nH  [0402]  66.8,75.69 0 top
L18  15nH  [0402]  65.02,74.93 90 top
L19  12nH  [0402]  65.53,72.64 0 top
L20  12nH  [0402]  76.2,75.69 0 top
R1  DNI  [0603]  -87.63,120.65 0 top  (outside the outline)
R2  DNI  [0603]  -91.44,120.65 0 top  (outside the outline)
R3  56R_10%  [0402]  -60.96,132.08 0 top  (outside the outline)
R4  4.7k  [0603]  -95.25,120.65 0 top  (outside the outline)
R5  10R  [0603]  -99.06,120.65 0 top  (outside the outline)
R6  10k  [0603]  -102.87,120.65 0 top  (outside the outline)
R7  10k  [0603]  -106.68,120.65 0 top  (outside the outline)
R8  10k  [0603]  -110.49,120.65 0 top  (outside the outline)
R9  10k  [0603]  -114.3,120.65 0 top  (outside the outline)
R10  2.2k  [0603]  -118.11,120.65 0 top  (outside the outline)
R11  10R  [0402]  63.25,84.84 0 top
R12  2.2k  [0603]  -121.92,120.65 0 top  (outside the outline)
R13  10k  [0603]  -125.73,120.65 0 top  (outside the outline)
R14  10k  [0603]  -129.54,120.65 0 top  (outside the outline)
R15  DNI  [0603]  -15.24,124.46 0 top  (outside the outline)
R16  DNI  [0603]  -19.05,124.46 0 top  (outside the outline)
R17  DNI  [0603]  -22.86,124.46 0 top  (outside the outline)
R18  DNI  [0603]  -26.67,124.46 0 top  (outside the outline)
R19  1R_1%  [0603]  -30.48,124.46 0 top  (outside the outline)
R20  1R_1%  [0603]  -34.29,124.46 0 top  (outside the outline)
R21  10k  [0603]  -38.1,124.46 0 top  (outside the outline)
R22  10k  [0603]  -41.91,124.46 0 top  (outside the outline)
R23  DNI  [0603]  -45.72,124.46 0 top  (outside the outline)
R24  DNI  [0603]  -49.53,124.46 0 top  (outside the outline)
R25  DNI  [0603]  -53.34,124.46 0 top  (outside the outline)
R26  DNI  [0603]  -57.15,124.46 0 top  (outside the outline)
R27  1R_1%  [0603]  -60.96,124.46 0 top  (outside the outline)
R28  1R_1%  [0603]  -64.77,124.46 0 top  (outside the outline)
R29  0.015R  [1206]  -58.42,96.52 0 top  (outside the outline)
R30  10k  [0603]  -68.58,124.46 0 top  (outside the outline)
R31  0.015R  [1206]  -64.77,96.52 0 top  (outside the outline)
R32  10k  [0603]  -72.39,124.46 0 top  (outside the outline)
R33  56k_1%  [0603]  56.64,84.58 180 top
R34  10k  [0603]  45.97,90.17 0 top
R35  DNI  [0402]  54.86,94.49 0 top
R36  4.7k  [0603]  -83.82,124.46 0 top  (outside the outline)
R37  DNI  [0603]  -87.63,124.46 0 top  (outside the outline)
R38  4.7k  [0603]  -91.44,124.46 0 top  (outside the outline)
R39  DNI  [0603]  -95.25,124.46 0 top  (outside the outline)
R40  10k  [0603]  -99.06,124.46 0 top  (outside the outline)
R41  120R  [0603]  -102.87,124.46 0 top  (outside the outline)
R42  [0603]  -95.25,138.43 0 top  (outside the outline)
R43  1M  [0603]  -106.68,124.46 0 top  (outside the outline)
R44  DNI  [0603]  -110.49,124.46 0 top  (outside the outline)
R45  DNI  [0603]  -114.3,124.46 0 top  (outside the outline)
R46  DNI  [0603]  -118.11,124.46 0 top  (outside the outline)
R47  DNI  [0603]  -121.92,124.46 0 top  (outside the outline)
R48  DNI  [0603]  -125.73,124.46 0 top  (outside the outline)
R49  DNI  [0603]  -129.54,124.46 0 top  (outside the outline)
R50  DNI  [0603]  -15.24,128.27 0 top  (outside the outline)
R51  DNI  [0603]  -19.05,128.27 0 top  (outside the outline)
R52  4.7k  [0603]  -22.86,128.27 0 top  (outside the outline)
R53  DNI  [0603]  -26.67,128.27 0 top  (outside the outline)
R54  DNI  [0603]  -30.48,128.27 0 top  (outside the outline)
R55  DNI  [0603]  -34.29,128.27 0 top  (outside the outline)
R56  DNI  [0603]  -38.1,128.27 0 top  (outside the outline)
R57  DNI  [0603]  -41.91,128.27 0 top  (outside the outline)
R58  DNI  [0603]  -45.72,128.27 0 top  (outside the outline)
R59  DNI  [0603]  -49.53,128.27 0 top  (outside the outline)
R60  DNI  [0603]  -53.34,128.27 0 top  (outside the outline)
R61  4.7k  [0603]  -57.15,128.27 0 top  (outside the outline)
R62  10k  [0603]  -60.96,128.27 0 top  (outside the outline)
R63  10k  [0603]  -64.77,128.27 0 top  (outside the outline)
R64  0R  [0603]  70.1,80.77 90 top
R65  10k  [0603]  70.61,83.82 90 top
R66  0.002R  [1812]  7.11,78.99 270 top
R67  10k  [0603]  1.78,72.39 90 top
R68  10k  [0603]  19.3,50.8 90 top
R69  255k_1%  [0603]  16.51,50.55 0 top
R70  27k_1%  [0603]  16.51,49.02 180 top
R71  100k  [0603]  -87.63,128.27 0 top  (outside the outline)
R72  100k  [0603]  -91.44,128.27 0 top  (outside the outline)
R73  51.7k_1%  [0603]  25.15,55.63 270 top
R74  11.5k_1%  [0603]  25.15,52.58 270 top
R75  24.9k  [0603]  12.95,49.53 180 top
R76  0.1R  [0603]  8.64,52.07 90 top
R77  56k_1%  [0603]  58.67,68.58 270 top
R78  10k  [0603]  49.53,74.93 0 top
R79  DNI  [0402]  59.94,79.5 270 top
R80  10R  [0402]  65.53,67.82 90 top
R81  10R  [0603]  -118.11,128.27 0 top  (outside the outline)
R82  10k  [0603]  -121.92,128.27 0 top  (outside the outline)
R83  10k  [0603]  -125.73,128.27 0 top  (outside the outline)
R84  10k  [0603]  -129.54,128.27 0 top  (outside the outline)
R85  DNI  [0603]  -15.24,132.08 0 top  (outside the outline)
R86  DNI  [0603]  -19.05,132.08 0 top  (outside the outline)
R87  DNI  [0603]  -22.86,132.08 0 top  (outside the outline)
R88  DNI  [0603]  -26.67,132.08 0 top  (outside the outline)
R89  DNI  [0603]  -30.48,132.08 0 top  (outside the outline)
R90  DNI  [0603]  -34.29,132.08 0 top  (outside the outline)
R91  4.7k  [0603]  -38.1,132.08 0 top  (outside the outline)
R92  4.7k  [0603]  -41.91,132.08 0 top  (outside the outline)
R93  10R  [0603]  -45.72,132.08 0 top  (outside the outline)
R94  10R  [0603]  -49.53,132.08 0 top  (outside the outline)
R95  10k  [0603]  -53.34,132.08 0 top  (outside the outline)
R96  10k  [0603]  -57.15,132.08 0 top  (outside the outline)
U1  Value  [TEXAS_INSTRUMENTS-RADAR-CC1200RHBR]  57.4,89.66 0 top
U2  Value  [ZWT0337A-IPC_A]  34.29,24.13 0 top
U3  Value  [PM0064A_N]  34.29,80.01 0 top
U4  Value  [TEXAS_INSTRUMENTS-CAN_TRANSCEIVER-TCAN1042/LED_DRIVER-TLC59731DR]  45.72,84.45 0 top
U5  TEXAS_INSTRUMENTS-AND_GATE-SN74LVC1G11_DCK_6  [TEXAS_INSTRUMENTS-AND_GATE-SN74LVC1G11_DCK_6]  -69.85,95.25 0 top  (outside the outline)
U6  ISSI-DRAM-IS42S16320F-7TL  [ISSI-DRAM-IS42S16320F-7TL]  49.53,24.13 0 top
U7  TMP100  [SOT23-6]  -62.23,74.93 0 top  (outside the outline)
U8  BMX160  [PQFN50P250X300X100-14N]  -59.69,83.82 0 top  (outside the outline)
U9  BMX160  [PQFN50P250X300X100-14N]  -67.31,83.82 0 top  (outside the outline)
U10  Value  [PWP0016K_N]  68.58,15.88 180 top
U11  Value  [PWP0016K_N]  68.58,23.5 180 top
U12  TEXAS_INSTRUMENTS-CURRENT_MONITOR-INA226_DGS_10  [TEXAS_INSTRUMENTS-CURRENT_MONITOR-INA226_DGS_10]  -24.13,96.52 0 top  (outside the outline)
U13  TEXAS_INSTRUMENTS-CURRENT_MONITOR-INA226_DGS_10  [TEXAS_INSTRUMENTS-CURRENT_MONITOR-INA226_DGS_10]  -31.75,96.52 0 top  (outside the outline)
U14  Value  [TEXAS_INSTRUMENTS-CAN_TRANSCEIVER-TCAN1042/LED_DRIVER-TLC59731DR]  19.68,33.66 180 top
U15  KIOXIA_AMERICA-NAND_FLASH-TC58CVG0S3HRAIG  [KIOXIA_AMERICA-NAND_FLASH-TC58CVG0S3HRAIG]  41.91,69.85 0 top
U16  KIOXIA_AMERICA-NAND_FLASH-TC58CVG0S3HRAIG  [KIOXIA_AMERICA-NAND_FLASH-TC58CVG0S3HRAIG]  29.84,36.83 0 top
U17  QORVO-RF_SWITCH-QPC7512  [QORVO-RF_SWITCH-QPC7512]  76.71,81.79 180 top
U18  TEXAS_INSTRUMENTS-CURRENT_MONITOR-INA226_DGS_10  [TEXAS_INSTRUMENTS-CURRENT_MONITOR-INA226_DGS_10]  2.79,78.49 90 top
U19  TEXAS_INSTRUMENTS-BUCK_CONVERTER-TPS53513RVER  [RVE28_TEX]  12.19,53.85 180 top
U20  Value  [TEXAS_INSTRUMENTS-RADAR-CC1200RHBR]  57.4,73.66 0 top
U21  Value  [PM0064A_N]  75.56,46.99 0 top
U22  Value  [TEXAS_INSTRUMENTS-CAN_TRANSCEIVER-TCAN1042/LED_DRIVER-TLC59731DR]  70.48,59.69 90 top
U23  TEXAS_INSTRUMENTS-AND_GATE-SN74LVC1G11_DCK_6  [TEXAS_INSTRUMENTS-AND_GATE-SN74LVC1G11_DCK_6]  -74.93,95.25 0 top  (outside the outline)
U24  KIOXIA_AMERICA-NAND_FLASH-TC58CVG0S3HRAIG  [KIOXIA_AMERICA-NAND_FLASH-TC58CVG0S3HRAIG]  81.92,33.66 0 top
U34  TMP100  [SOT23-6]  -71.12,74.93 0 top  (outside the outline)
X1  ECS_INC-OSCILLATOR-ECS-400-10-37-CKM-TR  [ECS_INC-OSCILLATOR-ECS-400-10-37-CKM-TR]  51.82,93.22 0 top
X2  BU-SMA-V  [BU-SMA-V]  85.09,90.17 0 top
X3  2510-  [PAK100/2500-10]  31.75,91.44 0 top
X4  2510-  [PAK100/2500-10]  56.52,4.45 180 top
X5  2510-  [PAK100/2500-10]  4.45,37.47 90 top
X6  5566-4  [5566-4]  10.16,88.9 0 top
X7  ECS_INC-OSCILLATOR-ECS-400-10-37-CKM-TR  [ECS_INC-OSCILLATOR-ECS-400-10-37-CKM-TR]  55.88,80.01 0 top
X8  2510-  [PAK100/2500-10]  85.72,64.77 270 top
Y1  20MHz  [ESC-OSCILLATOR-ECS_200_9_33B_CTP_TR]  -109.22,64.77 0 top  (outside the outline)
Y2  20MHz  [ESC-OSCILLATOR-ECS_200_9_33B_CTP_TR]  -116.84,64.77 0 top  (outside the outline)
Y3  20MHz  [ESC-OSCILLATOR-ECS_200_9_33B_CTP_TR]  -124.46,64.77 0 top  (outside the outline)

## Tracks (layer width: path | path; a pad name or v marks a point on that pad's centre or on a via)
!ADCS_FAILURE  (2 unrouted)
!CC1200_1_RESET  (via drill 0.2)  (1 unrouted)
  Top 0.152: U1.2 54.59,90.91 53.85,90.17 49.03,90.17 C51.1 v47.75,90.17 R34.2
!CC1200_1_SPI_CS  (1 unrouted)
  Top 0.152: U1.11 56.65,86.37 55.88,85.6 55.12,85.6 54.1,84.58
!CC1200_2_RESET  (via drill 0.3)  (1 unrouted)
  Top 0.254: U20.2 53.87,74.91 53.61,75.17 C215.1 51.55,75.17 v51.31,74.93 R78.2
!CC1200_2_SPI_CS  (1 unrouted)
!COMMS1_ERROR  (2 unrouted)
!COMMS1_JTAG_RST  (3 unrouted)
!COMMS1_NAND_CS  (1 unrouted)
!COMMS1_RESET  (3 unrouted)
!COMMS1_UNRESPONSIVE_FROM_SMC  (2 unrouted)
!COMMS2_ERROR  (2 unrouted)
!COMMS2_JTAG_RST  (3 unrouted)
!COMMS2_NAND_CS  (1 unrouted)
!COMMS2_RESET  (3 unrouted)
!COMMS2_UNRESPONSIVE_FROM_SMC  (2 unrouted)
!GLOBAL_RESET  (9 unrouted)
!MTQ_12_FAULT  (2 unrouted)
!MTQ_12_SLEEP  (2 unrouted)
!MTQ_34_FAULT  (2 unrouted)
!MTQ_34_SLEEP  (2 unrouted)
!SDRAM_CAS  (1 unrouted)
!SDRAM_CS  (1 unrouted)
!SDRAM_RAS  (1 unrouted)
!SDRAM_WE  (1 unrouted)
!SMC_NAND_CS  (1 unrouted)
!SMC_TRST  (3 unrouted)
!SMC_UNRESPONSIVE1_PRE  (1 unrouted)
!SMC_UNRESPONSIVE2_PRE  (1 unrouted)
!SMC_UNRESPONSIVE_FROM_COMMS1  (2 unrouted)
!SMC_UNRESPONSIVE_FROM_COMMS2  (2 unrouted)
!TPS53513_PGOOD  (via drill 0.25)  (2 unrouted)
  Top 0.203: U19.2 14.66,52.65 15.24,52.07 17.78,52.07 18.27,51.58 R68.2 20.56,51.58 v20.57,51.56
ADC_A0  (2 unrouted)
ADC_A1  (2 unrouted)
ADC_A2  (2 unrouted)
ADC_A3  (2 unrouted)
ADC_A4  (2 unrouted)
ADC_A5  (2 unrouted)
ADC_B0  (2 unrouted)
ADC_B1  (2 unrouted)
ADC_B2  (2 unrouted)
ADC_B3  (2 unrouted)
ADC_B4  (2 unrouted)
ADC_B5  (2 unrouted)
ADCS_ERROR  (1 unrouted)
ADCS_ONLINE  (1 unrouted)
ANT1_PREMUX_50Z
  Top 0.196: L10.1 76.71,87.59 L7.2 C26.2
ANT2_PREMUX_50Z
  Top 0.196: L11.1 76.75,78.15 L20.2 C263.2
ANTENNA
  Top 0.196: L8.2 X2.1
BMX160_1_INT1  (3 unrouted)
BMX160_1_INT2  (3 unrouted)
BMX160_2_INT1  (3 unrouted)
BMX160_2_INT2  (3 unrouted)
CANH  (6 unrouted)
CANL  (6 unrouted)
CC1200_1_SPI_CLK  (1 unrouted)
  Top 0.152: U1.8 54.38,87.91 52.32,85.85
CC1200_1_SPI_MISO  (1 unrouted)
  Top 0.152: U1.9 55.65,87.01 55.15,86.5 55.15,86.39 53.59,84.84
CC1200_1_SPI_MOSI  (1 unrouted)
  Top 0.152: U1.7 54.12,88.41 52.02,86.31
CC1200_2_SPI_CLK  (1 unrouted)
CC1200_2_SPI_MISO  (1 unrouted)
CC1200_2_SPI_MOSI  (1 unrouted)
COMMS1_CAN_RX  (1 unrouted)
COMMS1_CAN_STB  (1 unrouted)
COMMS1_CAN_TX  (1 unrouted)
COMMS1_I2C0_SCL  (1 unrouted)
COMMS1_I2C0_SDA  (1 unrouted)
COMMS1_NAND_MISO  (1 unrouted)
COMMS1_NAND_MOSI  (1 unrouted)
COMMS1_NAND_SCK  (1 unrouted)
COMMS1_NMI  (3 unrouted)
COMMS1_UART_RX  (2 unrouted)
COMMS1_UART_TX  (2 unrouted)
COMMS2_CAN_RX  (1 unrouted)
COMMS2_CAN_STB  (1 unrouted)
COMMS2_CAN_TX  (1 unrouted)
COMMS2_I2C0_SCL  (1 unrouted)
COMMS2_I2C0_SDA  (1 unrouted)
COMMS2_NAND_MISO  (1 unrouted)
COMMS2_NAND_MOSI  (1 unrouted)
COMMS2_NAND_SCK  (1 unrouted)
COMMS2_NMI  (3 unrouted)
COMMS2_UART_RX  (2 unrouted)
COMMS2_UART_TX  (2 unrouted)
CPLD_I1  (1 unrouted)
CPLD_I2  (1 unrouted)
CPLD_I3  (1 unrouted)
CPLD_I4  (1 unrouted)
CPLD_O1  (1 unrouted)
CPLD_O2  (1 unrouted)
CPLD_O3  (1 unrouted)
CPLD_O4  (1 unrouted)
EPWM1A  (2 unrouted)
EPWM1B  (2 unrouted)
EPWM2A  (2 unrouted)
EPWM2B  (2 unrouted)
EPWM3A  (2 unrouted)
EPWM3B  (2 unrouted)
EPWM4A  (2 unrouted)
EPWM4B  (2 unrouted)
LNA1_N
  Top 0.196: U1.20 60.96,89.41 62.53,90.97 L5.2 63.8,90.97 64.01,91.19 L4.1 C24.2
LNA1_P
  Top 0.196: U1.19 61.23,88.91 62.19,89.87 L5.1 63.75,89.87 63.97,89.66 C23.1 64.47,89.15 64.22,88.9 L6.2
LNA2_N
  Top 0.196: U20.20 62.74,73.41 64.26,74.93 64.47,74.93 L18.2 65.24,75.69 L17.1 66.25,76.79 C261.2
LNA2_P
  Top 0.196: U20.19 63,72.91 64.52,74.42 64.98,74.42 L18.1 65.24,74.17 C260.1 66.25,72.81 L19.2
MAIN_CURRENT_ALERT  (1 unrouted)
  Top 0.152: U18.3 2.79,74.68 1.78,73.66 R67.2 2.53,73.17 2.79,72.9 2.79,70.87 2.54,70.61 2.54,69.6
MTQ1_OUT1  (1 unrouted)
MTQ1_OUT2  (1 unrouted)
MTQ2_OUT1  (1 unrouted)
MTQ2_OUT2  (1 unrouted)
MTQ3_OUT1  (1 unrouted)
MTQ3_OUT2  (1 unrouted)
MTQ4_OUT1  (1 unrouted)
MTQ4_OUT2  (1 unrouted)
MTQ_12_ALERT  (2 unrouted)
MTQ_12_VCC  (7 unrouted)
MTQ_34_ALERT  (2 unrouted)
MTQ_34_VCC  (5 unrouted)
N$1  (1 unrouted)
N$2  (5 unrouted)
N$3  (1 unrouted)
N$4  (1 unrouted)
N$5
  Top 0.196: L1.1 C21.1 C20.2
N$6
  Top 0.196: L4.2 66.34,91.19 L3.1 66.29,90.21 66.12,90.21 C23.2
N$7
  Top 0.196: L2.1 71.08,87.12 70.57,86.61 C21.2 L1.2 70.15,88.39 69.89,88.65 68.07,88.65 67.86,88.43 C22.1
N$8  (1 unrouted)
N$9
  Top 0.196: C26.1 L7.1 75.61,87.67 C25.1 73.74,87.67 73.19,87.12 L2.2
N$10  (1 unrouted)
N$11
  Top 0.196: L9.2 63.84,84.79 | 63.84,84.79 R11.2 | C77.2 63.8,84.75 63.84,84.79
N$12  (1 unrouted)
N$13  (1 unrouted)
N$14  (1 unrouted)
N$15  (1 unrouted)
N$16  (1 unrouted)
N$17  (2 unrouted)
N$18  (1 unrouted)
N$19  (1 unrouted)
N$20  (1 unrouted)
N$21  (3 unrouted)
N$22  (1 unrouted)
N$23
  Top 0.254: U1.14 58.15,86.64 58.44,86.35 58.44,85.61 R33.1
N$24
  Top 0.196: U1.30 56.65,92.45 55.74,93.36 54.39,93.36 53.89,93.87 X1.3 51.82,94.67 50.47,94.67 50.04,94.23 C49.1
N$25
  Top 0.196: U1.31 56.15,92.18 55.63,92.71 54.61,92.71 53.59,91.69 51.89,91.69 X1.1 49.4,92.57
  Top 0.254: 49.4,92.57 C50.1
N$26  (1 unrouted)
N$27  (1 unrouted)
N$28  (1 unrouted)
N$29  (1 unrouted)
N$30  (1 unrouted)
N$31
  Top 0.196: C52.1 61.17,92.41 60.17,91.41 U1.24
N$32
  Top 0.196: U1.23 60.47,90.91 C52.2
N$33
  Top 0.254: U1.26 58.65,92.45 58.95,92.74 58.95,93.79 C56.2
N$34
  Top 0.254: U1.29 57.01,92.21 57.01,92.6 56.85,92.75 C55.2 R35.2
N$35  (via drill 0.3)
  Top 0.254: U1.21 v60.71,89.92
  Bottom 0.254: C54.2 v60.71,89.92
N$36
  Top 0.254: U1.6 54.36,88.91 54.32,88.88 53.88,88.88 53.86,88.9 C53.2
N$37  (2 unrouted)
N$38  (2 unrouted)
N$39  (2 unrouted)
N$40
  Top 0.196: U17.2 83.31,81.79 arc90 85.09,83.57 L8.1
N$41
  Top 0.196: U17.11 L11.2
N$42
  Top 0.196: L10.2 U17.5
N$43
  Top 0.254: U19.1 14.3,52.25 14.99,51.56 16.27,51.56 R69.2 R70.1
N$44  (1 unrouted)
N$45  (1 unrouted)
N$46
  pour Top (rank 4): 18.03,52.58 13.21,52.58 13.21,55.12 18.03,55.12
N$47
  pour Top (isolate 0.254, rank 3): 14.99,54.1 13.21,54.1 13.21,58.93 11.94,58.93 11.94,69.34 21.08,69.34 21.08,55.37 14.99,55.37
  pour Top (rank 3, no thermals): 13.97,54.1 14.99,54.1 14.99,54.61 14.99,56.13 13.46,56.13 13.46,54.1
N$48
  Top 0.203: U19.25 11.79,50.95 12.18,50.56 R75.2
N$49
  Top 0.254: R76.2 8.84,53.05 U19.21
N$50
  Top 0.254: U20.14 58.15,70.88 58.67,70.36 R77.1
N$51
  Top 0.196: U20.30 56.65,77.99 57.66,78.99 57.66,79.76 56.75,80.66 X7.3 56.68,82.27 C213.1
N$52
  Top 0.196: U20.31 56.15,77.45 55.08,78.52 X7.1 54.95,79.49 C214.1
N$53
  Top 0.254: U20.24 60.17,75.41 61.17,76.41 C216.1
N$54
  Top 0.254: U20.23 60.43,74.91 61.47,75.95 61.72,75.95 62.27,76.5 C216.2
N$55
  Top 0.254: U20.26 58.65,76.31 58.91,76.57 58.91,76.95 59.68,77.72 60.41,77.72 60.66,77.98 C220.2
N$56
  Top 0.254: U20.29 57.15,76.46 57.13,76.49 57.13,77.19 58.17,78.23 58.42,78.23 58.67,78.49 C219.2 R79.2
N$57
  Top 0.254: U20.21 60.96,73.91 61.21,74.17 61.93,74.17 C218.2
N$58
  Top 0.254: U20.6 54.62,72.91 54.36,72.64 C217.2
N$59
  Top 0.196: L13.2 R80.2 C232.2
N$60  (1 unrouted)
N$61  (3 unrouted)
N$62  (1 unrouted)
N$63  (1 unrouted)
N$64  (1 unrouted)
N$65  (1 unrouted)
N$66  (5 unrouted)
N$67  (1 unrouted)
N$68  (1 unrouted)
N$69
  Top 0.196: C258.1 L14.1 69.6,70.1 69.09,70.61 C257.2
N$70
  Top 0.196: L15.1 71.37,74.38 71.37,73.91 71.16,73.7 C259.1 C258.2 L14.2
N$71
  Top 0.196: C260.2 67.39,74.21 L16.1 68.83,74.93 68.07,75.69 L17.2
N$72
  Top 0.196: L20.1 C263.1 75.61,74.46 C262.1 72.47,74.46 L15.2
N$73  (2 unrouted)
N$74  (2 unrouted)
PA  (1 unrouted)
  Top 0.196: U1.17 61.86,85.85 64.98,85.85 65,85.87 | C20.1 66,85.85 65.02,85.85 65,85.87 | 65,85.87 L9.1 | U20.17 59.92,71.91 61.21,70.61 65.49,70.61 L13.1 67.23,70.65 C257.1
RF_MUX_CTRL  (via drill 0.2)  (1 unrouted)
  Top 0.152: U17.7 74.94,82.29 74.18,83.05 C193.1 R65.1 70.6,83.06 69.09,83.06 68.85,82.82 C194.1 67.81,82.8 v66.55,82.8
RF_MUX_EN  (via drill 0.2)
  Top 0.152: U17.8 74.42,81.79 74.18,81.55 C192.1 R64.2 70.09,81.53 v69.09,81.53
SDRAM_A0  (1 unrouted)
SDRAM_A1  (1 unrouted)
SDRAM_A2  (1 unrouted)
SDRAM_A3  (1 unrouted)
SDRAM_A4  (1 unrouted)
SDRAM_A5  (1 unrouted)
SDRAM_A6  (1 unrouted)
SDRAM_A7  (1 unrouted)
SDRAM_A8  (1 unrouted)
SDRAM_A9  (1 unrouted)
SDRAM_A10  (1 unrouted)
SDRAM_A11  (1 unrouted)
SDRAM_A12  (1 unrouted)
SDRAM_BA0  (1 unrouted)
SDRAM_BA1  (1 unrouted)
SDRAM_CKE  (1 unrouted)
SDRAM_CLK  (1 unrouted)
SDRAM_D0  (1 unrouted)
SDRAM_D1  (1 unrouted)
SDRAM_D2  (1 unrouted)
SDRAM_D3  (1 unrouted)
SDRAM_D4  (1 unrouted)
SDRAM_D5  (1 unrouted)
SDRAM_D6  (1 unrouted)
SDRAM_D7  (1 unrouted)
SDRAM_D8  (1 unrouted)
SDRAM_D9  (1 unrouted)
SDRAM_D10  (1 unrouted)
SDRAM_D11  (1 unrouted)
SDRAM_D12  (1 unrouted)
SDRAM_D13  (1 unrouted)
SDRAM_D14  (1 unrouted)
SDRAM_D15  (1 unrouted)
SDRAM_DQM0  (1 unrouted)
SDRAM_DQM1  (1 unrouted)
SMC_ERR_CPLD_IN  (1 unrouted)
SMC_ERR_OUT  (2 unrouted)
SMC_I2C0_SCL  (9 unrouted)
  Top 0.152: U18.5 3.81,76.37 3.81,69.6
SMC_I2C0_SDA  (9 unrouted)
  Top 0.152: U18.2 2.29,77.22 2.54,77.47 3.05,77.47 3.29,77.22 U18.4 3.3,76.38 3.3,69.6
SMC_I2C1_SCL  (2 unrouted)
SMC_I2C1_SDA  (2 unrouted)
SMC_MCAN_RX  (1 unrouted)
SMC_MCAN_STB  (2 unrouted)
SMC_MCAN_TX  (1 unrouted)
SMC_NAND_MISO  (1 unrouted)
SMC_NAND_MOSI  (1 unrouted)
SMC_NAND_SCK  (1 unrouted)
SMC_TCK  (1 unrouted)
SMC_TDI  (1 unrouted)
SMC_TDO  (1 unrouted)
SMC_TMS  (2 unrouted)
SMC_UART0_RX  (2 unrouted)
SMC_UART0_TX  (2 unrouted)
TPS53513_FB
  Top 0.254: R73.2 R74.1 23.88,52.08 23.88,49.28 22.61,48.01 12.19,48.01 10.41,49.78 10.41,52.17 U19.23
TPS53513_VREG  (via drill 0.25)
  Top 0.254: R69.1 v14.73,50.55
  other vias: 9.65,50.04 8.64,50.04 8.64,49.02 9.65,49.02
  pour Top (rank 2): 10.92,53.59 6.1,53.59 6.1,52.58 5.08,52.58 5.08,48.26 10.92,48.26
  pour Bottom: 8.38,48.26 16,48.26 16,50.55 16,51.56 12.7,51.56 7.62,51.56 7.62,49.02 7.62,48.26
TRX1_SW
  Top 0.196: U1.18 60.69,88.41 61.98,87.12 66.04,87.12 66.8,87.88 | C22.2 66.8,87.88 | L3.2 66.8,87.88
TRX2_SW
  Top 0.196: U20.18 60.43,72.41 60.96,71.88 67.06,71.88 68.28,73.11 L16.2 68.88,73.15 C259.2
VCC_3V3_IO  (via drill 0.2, 0.25, 0.3, 0.35, 0.55)  (279 unrouted)
  Top 0.152: R67.1 v1.78,70.61 | R64.1 v70.1,78.99 | R34.1 v44.2,90.17
  Top 0.196: v61.72,84.84 R11.1 C77.1 v61.72,83.57 | C78.1 60.96,84.84 | 60.96,84.84 v61.72,84.84 | v61.72,83.57 C79.1 60.75,84.62 60.96,84.84 | v61.72,84.84 v61.72,83.57 | C232.1 v66.8,66.29 | R80.1 v65.53,66.29 | C234.1 v68.07,67.82 | C233.1 v68.07,66.04
  Top 0.203: U19.24 11.39,51.02 v11.18,50.8 | R68.1 v19.3,49.02
  Top 0.254: U18.6 3.79,79.26 v4.06,78.99 | 25.15,63.29 L12.2 22.61,64.52 22.1,64.01 22.1,60.2 25.15,57.15 R73.1 | C190.1 v69.09,77.22 | C191.1 74.17,80.52 74.68,81.03 v74.93,81.03 75.19,81.29 U17.9 | U1.15 58.65,86.89 v58.93,86.61 | U1.13 57.65,86.36 v57.91,86.11 | U1.12 57.15,86.11 v56.9,85.85 | U1.5 v54.1,89.41 | U1.1 54.33,91.41 v53.85,90.93 | U1.28 57.65,92.71 v57.4,92.96 | U1.27 58.15,92.7 v58.42,92.96 | U1.25 59.41,92.32 59.41,92.69 v59.94,93.22 | U1.22 60.45,90.41 60.49,90.45 60.98,90.45 v61.21,90.68 | R35.1 v53.59,94.49 | U20.22 60.69,74.41 v61.21,74.93 | U20.25 59.15,76.17 59.69,76.71 v59.69,76.96 | U20.28 v57.66,76.71 | U20.27 58.15,76.37 58.29,76.51 58.29,77.34 v58.42,77.47 | U20.1 54.38,75.41 v54.1,75.69 | U20.5 v54.1,73.41 | U20.12 57.15,70.36 v56.9,70.1 | U20.13 57.65,70.36 v57.91,70.1 | U20.15 58.65,71.14 v59.44,70.36 | R78.1 v47.75,74.93 | R79.1 v59.94,81.03 | U3.2 27.23,83.26 v26.92,83.57 | U3.11 27.16,78.76 v26.92,78.99 | U3.26 35.04,73.14 v34.8,72.9 | U3.42 41.64,80.76 v41.91,81.03 | U3.54 35.54,87.1 v35.81,87.38
  Bottom 0.254: C195.1 4.06,79.23 v4.06,78.99 | C62.1 58.17,85.85 v57.91,86.11 | v56.9,85.85 C63.1 | C65.1 58.42,87.12 v58.93,86.61 | C64.1 61.43,90.89 v61.21,90.68 | C61.1 60.2,93.47 v59.94,93.22 | C60.1 57.95,93.43 v58.42,92.96 58.42,92.47 C67.1 57.4,91.94 v57.4,92.96 C59.1 | C57.1 v53.85,90.93 | C58.1 v54.1,89.41 54.37,89.67 C66.1 | C229.1 52.87,75.69 v54.1,75.69 | C228.1 57.19,77.17 v57.66,76.71 57.42,76.47 C230.1 | C226.1 59.99,77.26 v59.69,76.96 | C227.1 53.38,72.69 v54.1,73.41 | C225.1 v56.9,70.1 | C224.1 59.73,70.06 v59.44,70.36 | C223.1 v57.91,70.1 | C221.1 58.89,77.94 v58.42,77.47 | C222.1 61.47,74.68 v61.21,74.93 60.95,74.93 C231.1
  other vias: 30.23,65.79 32,65.79 32,64.01 30.23,64.01 30.23,62.23 32,62.23 32,60.45 30.23,60.45
  pour Top: 31.5,57.4 26.16,57.4 25.15,58.42 24.89,58.67 23.11,60.45 23.11,63.75 23.11,69.34 27.94,69.34 29.21,69.34 29.97,68.58 32.26,68.58 35.81,68.58 35.81,63.75 35.81,57.4
VCC_5V0  (via drill 0.25, 0.35, 0.5)  (20 unrouted)
  Top 0.203: U19.3 15.02,53.05 15.49,52.58 v18.54,52.58
  Top 0.254: U18.9 2.29,81.8 v2.54,82.04 3.06,82.56 C267.2
  other vias: 6.86,73.15 5.33,68.58 5.33,73.15 6.86,68.58 6.86,71.63 5.33,71.63 5.33,70.1 6.86,70.1 5.33,66.55 5.33,64.01 5.33,61.47 5.33,58.93
  pour Top: 10.67,56.13 8.89,56.13 8.89,57.4 8.13,57.4 8.13,69.09 9.4,69.09 9.4,76.45 10.92,76.45 10.92,78.74 4.57,78.74 4.57,86.36 0,86.36 0,51.56 4.57,51.56 4.57,52.83 5.84,52.83 5.84,53.85 10.67,53.85
  pour Top (no thermals): 10.67,53.85 9.65,53.85 9.65,54.86 9.65,56.13 10.67,56.13
VDD_CORE  (34 unrouted)
VINPUT  (via drill 0.35)  (2 unrouted)
  Top 0.254: U18.8 v2.79,78.99 | C267.1 1.51,82.31 1.79,82.03 U18.10
  pour Top: 7.62,79.25 5.08,79.25 5.08,81.03 5.08,86.87 3.3,86.87 0,86.87 0,89.15 0,95.76 4.06,95.76 9.91,95.76 9.91,90.93 9.91,84.07 9.91,83.57 10.92,83.57 11.68,83.57 11.68,81.28 11.68,79.25
VSS  (via drill 0.2, 0.25, 0.3, 0.35, 0.5, 0.55)  (469 unrouted)
  Top 0.152: C192.2 v72.39,78.99 | U17.13 76.22,82.28 76.22,82.41 76.21,82.42 U17.6 | 77.21,82.29 U17.4 | U17.13 77.21,82.29 | 77.21,82.29 77.98,82.29 | 77.21,81.29 U17.1 | U17.13 77.21,81.29 | 77.21,81.29 U17.12 | U17.13 76.22,81.3 76.22,81.17 76.21,81.16 U17.10 | R65.2 v70.61,85.6 | C193.2 v72.9,85.6 | C194.2 v67.82,80.26 | C51.2 v49.02,87.63
  Top 0.196: U17.3 77.98,82.29 78.22,82.29 v78.49,82.55 | U17.1 78.22,81.29 v78.49,81.03 | U17.12 77.21,80.27 v77.47,80.01 | U17.10 76.21,80.27 v75.95,80.01 | U17.4 77.21,83.3 v77.47,83.57 | U17.6 76.21,83.3 v75.95,83.57 | C25.2 74.46,86.61 v75.44,86.61 | L6.1 v66.04,88.39 | C24.1 v66.55,92.46 | C78.2 v58.67,84.84 | C79.2 v58.67,83.57 | C262.2 v74.17,72.39 | C261.1 v64.01,76.96 | L19.1 v64.01,72.64 | C234.2 v71.12,67.82 | v71.12,66.04 C233.2 | v53.34,82.04 C214.2 | C213.2 v54.1,82.3
  Top 0.203: v9.65,52.32 9.98,52.65 U19.22 12.19,52.65 U19.29 | 12.59,53.85 U19.27 12.59,51.16 v12.95,50.8 | 12.99,53.85 U19.28 13.63,51.65 v13.72,51.56 | U19.29 11.39,53.85 U19.14 | U19.29 11.79,53.85 U19.13 | U19.29 U19.12 | U19.29 12.59,53.85 | 12.59,53.85 U19.11 | U19.29 12.99,53.85 | 12.99,53.85 U19.10 | v13.97,50.8 13.97,50.53 13.73,50.29 R75.1
  Top 0.254: U18.7 3.29,81.78 v3.56,82.04 | U18.1 1.79,75.2 v1.52,74.93 | C203.2 v4.83,56.64 | C204.2 v4.83,55.12 | C205.2 v3.81,52.32 | C206.2 v7.11,50.04 | R74.2 v25.15,50.8 | R70.2 v14.73,49.02 | C190.2 v72.64,77.22 | C191.2 v74.17,77.47 | v54.86,91.95 55.01,91.95 55.12,92.06 U1.32 55.65,91.41 U1.33 | U1.33 v59.94,92.2 | v59.94,92.2 | U1.33 v54.86,87.12 | v54.86,87.12 | U1.33 59.94,87.12 v59.94,86.87 | C49.2 v46.74,94.23 | C50.2 v46.74,92.46 | R33.2 v54.86,84.58 | C55.1 v58.67,94.49 | C56.1 v61.72,94.49 | C53.1 52.03,88.1 v51.82,87.88 | U20.33 v54.86,76.2 | v54.86,76.2 | U20.32 55.65,76.68 v55.37,76.96 | U20.33 v59.94,76.2 | v59.94,76.2 | U20.33 v54.86,71.12 | v54.86,71.12 | U20.33 | U20.33 v59.94,71.12 | v63.25,77.98 C220.1 | C219.1 v58.67,81.03 | C227.2 v51.31,72.64 | C218.1 62.78,75.23 v62.99,75.44 | R77.2 v58.67,66.8 | C215.2 v52.83,77.72 | U3.3 27.13,82.76 v26.92,82.55 | U3.12 27.21,78.26 v26.92,77.98 | U3.27 35.54,73.17 v35.81,72.9 | U3.39 41.64,79.26 v41.91,78.99 | U3.55 35.04,87.13 v34.8,87.38
  Bottom 0.254: C195.2 4.05,81.55 v3.56,82.04 | C54.1 62.74,89.87 v62.74,88.9 | C62.2 v60.96,85.85 | C63.2 v53.59,85.85 | C58.2 v51.05,89.41 | C57.2 v50.8,90.93 | C59.2 v53.85,92.96 | C60.2 56.41,94.23 v56.13,93.96 | C61.2 v62.74,93.47 | C64.2 63.25,91.69 v63.5,91.95 | C65.2 56.45,87.12 v56,86.68 | C67.2 59.7,92.2 v59.94,92.2 | C66.2 55.12,87.38 v54.86,87.12 | C229.2 51.77,76.75 v51.56,76.96 | C228.2 55.37,77 v55.37,76.96 | C226.2 59.99,76.16 v59.94,76.2 | C227.2 v51.31,72.64 | v54.86,71.12 54.86,70.15 C225.2 | v59.94,71.12 59.99,71.16 | 59.99,71.16 C224.2 | C223.2 57.87,68.07 v56.9,68.07 | C221.2 60.71,78.74 v60.96,78.99 | C222.2 62.99,74.72 v62.99,75.44 | C231.2 60.2,72.14 59.94,71.88 59.94,71.2 59.99,71.16 | C230.2 55.1,76.2 v54.86,76.2
  other vias: 14.73,82.3 14.73,80.77 16,80.77 16,82.3 12.45,74.42 13.72,74.42 12.45,72.9 13.72,72.9 12.45,70.1 13.72,70.1 13.72,71.63 12.45,71.63 12.45,67.56 12.45,66.04 12.45,64.52 12.45,62.74 12.45,60.96 12.45,59.44 12.45,57.91 11.18,57.91 11.18,59.44 11.18,60.96 11.18,62.74 11.18,64.52 11.18,66.04 11.18,67.56 39.62,61.98 39.62,60.45 39.62,63.75 39.62,65.28 31.24,54.61 31.24,71.63 33.27,71.63 35.05,71.63 79.5,82.55 80.52,82.55 81.53,82.55 82.55,82.55 79.5,81.03 80.52,81.03 81.53,81.03 82.55,81.03 85.34,81.79 84.33,83.44 83.69,82.68 83.57,81.03 84.58,81.28 85.72,82.55 85.85,83.44 84.33,86.36 85.85,86.36 84.07,85.34 86.11,85.34 86.11,84.33 84.07,84.33
  pour Top (rank 2): 8.64,59.18 8.64,55.37 13.46,55.37 13.46,69.09 14.99,69.09 14.99,75.95 9.91,75.95 9.91,68.58 8.64,68.58
  pour Top (no thermals): 11.18,55.63 13.46,55.63 13.46,56.9 11.18,56.9
  pour Top: 32.51,69.09 30.23,69.09 30.23,71.37 30.23,72.64 31.75,72.64 36.07,72.64 36.07,70.87 36.07,69.09
  pour Top: 36.32,66.42 36.32,58.67 40.64,58.67 40.64,66.42
  pour Top: 30.99,56.9 32.77,56.9 32.77,55.88 32.77,53.59 30.99,53.59 29.72,53.59 29.72,56.13 29.72,56.9
  pour Top: 12.19,82.04 12.19,79.25 13.21,79.25 17.02,79.25 17.02,81.28 17.02,95.76 15.24,95.76 10.41,95.76 10.41,90.93 10.41,84.07 11.68,84.07 12.19,84.07